# EAGLE schematic PCBNewLdo (EAGLE 9.6.2)
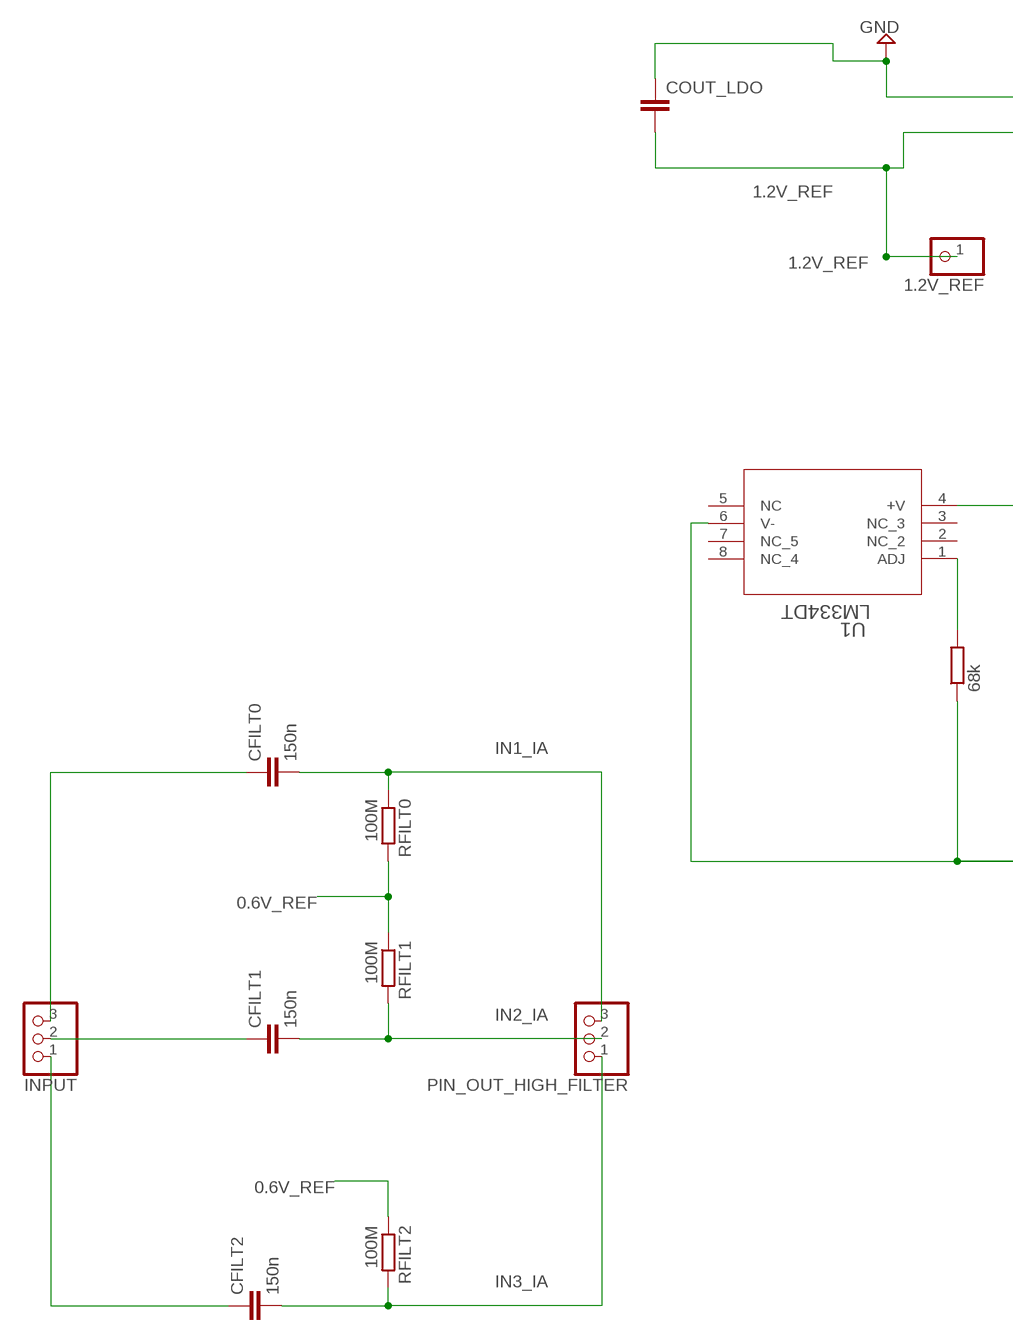
[diagram p0: schematic, sheet 1, part 1 of 2]
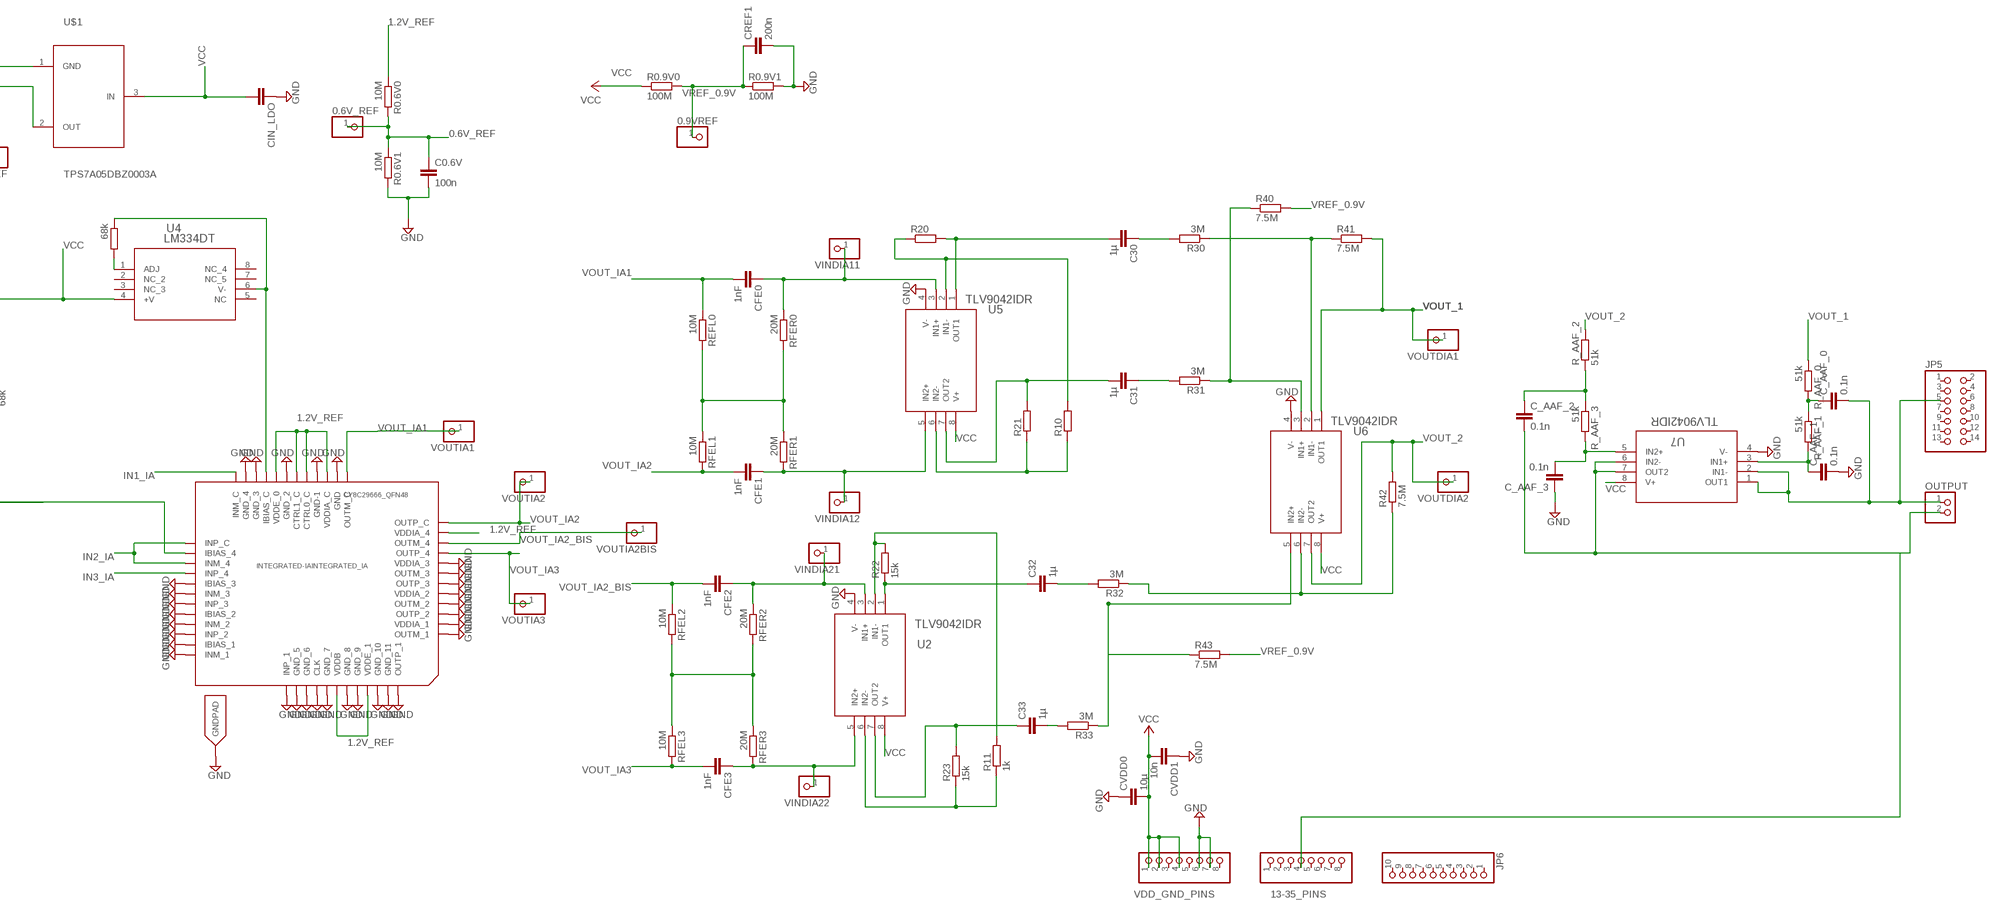
[diagram p1: schematic, sheet 1, part 2 of 2]

## Parts
0.6V_REF  PINHD-1X1  [1X01]
0.9VREF  PINHD-1X1  [1X01]
1.2V_REF  PINHD-1X1  [1X01]
13-35_PINS  PINHD-1X8  [1X08]
C0.6V  100n  C-EUC0603  [C0603]
C30  1µ  C-EUC0603  [C0603]
C31  1µ  C-EUC0603  [C0603]
C32  1µ  C-EUC0603  [C0603]
C33  1µ  C-EUC0603  [C0603]
C_AAF_0  0.1n  C-EUC0603  [C0603]
C_AAF_1  0.1n  C-EUC0603  [C0603]
C_AAF_2  0.1n  C-EUC0603  [C0603]
C_AAF_3  0.1n  C-EUC0603  [C0603]
CFE0  1nF  C-EUC0603  [C0603]
CFE1  1nF  C-EUC0603  [C0603]
CFE2  1nF  C-EUC0603  [C0603]
CFE3  1nF  C-EUC0603  [C0603]
CFILT0  150n  C-EUC0603  [C0603]
CFILT1  150n  C-EUC0603  [C0603]
CFILT2  150n  C-EUC0603  [C0603]
CIN_LDO  1µ  C-EUC0603  [C0603]
COUT_LDO  4.7µ  C-EUC0603  [C0603]
CREF1  200n  C-EUC0603  [C0603]
CVDD0  10µ  C-EUC0603  [C0603]
CVDD1  10n  C-EUC0603  [C0603]
INPUT  PINHD-1X3  [1X03]
INTEGRATED-IA  CY8C29666_QFN48  [QFN48]
JP5  PINHD-2X7  [2X07]
JP6  PINHD-1X10  [1X10]
OUTPUT  PINHD-1X2  [1X02]
PIN_OUT_HIGH_FILTER  PINHD-1X3  [1X03]
R0.6V0  10M  R-EU_R0603  [R0603]
R0.6V1  10M  R-EU_R0603  [R0603]
R0.9V0  100M  R-EU_R0603  [R0603]
R0.9V1  100M  R-EU_R0603  [R0603]
R10  R-EU_R0603  [R0603]
R11  1k  R-EU_R0603  [R0603]
R20  R-EU_R0603  [R0603]
R21  R-EU_R0603  [R0603]
R22  15k  R-EU_R0603  [R0603]
R23  15k  R-EU_R0603  [R0603]
R30  3M  R-EU_R0603  [R0603]
R31  3M  R-EU_R0603  [R0603]
R32  3M  R-EU_R0603  [R0603]
R33  3M  R-EU_R0603  [R0603]
R40  7.5M  R-EU_R0603  [R0603]
R41  7.5M  R-EU_R0603  [R0603]
R42  7.5M  R-EU_R0603  [R0603]
R43  7.5M  R-EU_R0603  [R0603]
R_AAF_0  51k  R-EU_R0603  [R0603]
R_AAF_1  51k  R-EU_R0603  [R0603]
R_AAF_2  51k  R-EU_R0603  [R0603]
R_AAF_3  51k  R-EU_R0603  [R0603]
REFL0  10M  R-EU_R0603  [R0603]
RFEL1  10M  R-EU_R0603  [R0603]
RFEL2  10M  R-EU_R0603  [R0603]
RFEL3  10M  R-EU_R0603  [R0603]
RFER0  20M  R-EU_R0603  [R0603]
RFER1  20M  R-EU_R0603  [R0603]
RFER2  20M  R-EU_R0603  [R0603]
RFER3  20M  R-EU_R0603  [R0603]
RFILT0  100M  R-EU_R0603  [R0603]
RFILT1  100M  R-EU_R0603  [R0603]
RFILT2  100M  R-EU_R0603  [R0603]
RLM334_0  68k  R-EU_R0603  [R0603]
RLM334_1  68k  R-EU_R0603  [R0603]
U1  LM334DT  [SO-8_STM]
U2  TLV9042IDR  [SOIC8_D_TEX]
U4  LM334DT  [SO-8_STM]
U5  TLV9042IDR  [SOIC8_D_TEX]
U6  TLV9042IDR  [SOIC8_D_TEX]
U7  TLV9042IDR  [SOIC8_D_TEX]
U$1  TPS7A05DBZ0003A  [TFE]
VDD_GND_PINS  PINHD-1X8  [1X08]
VINDIA11  PINHD-1X1  [1X01]
VINDIA12  PINHD-1X1  [1X01]
VINDIA21  PINHD-1X1  [1X01]
VINDIA22  PINHD-1X1  [1X01]
VOUTDIA1  PINHD-1X1  [1X01]
VOUTDIA2  PINHD-1X1  [1X01]
VOUTIA1  PINHD-1X1  [1X01]
VOUTIA2  PINHD-1X1  [1X01]
VOUTIA2BIS  PINHD-1X1  [1X01]
VOUTIA3  PINHD-1X1  [1X01]

## Nets
0.6V_REF: 0.6V_REF.1 C0.6V.1 R0.6V0.2 R0.6V1.1 RFILT0.2 RFILT1.1 RFILT2.1
1.2V_REF: 1.2V_REF.1 COUT_LDO.2 INTEGRATED-IA.11(INTEGRATED_IA:VDDIA_4) INTEGRATED-IA.15(INTEGRATED_IA:VDDIA_C) INTEGRATED-IA.17(INTEGRATED_IA:CTRL0_C) INTEGRATED-IA.18(INTEGRATED_IA:CTRL1_C) INTEGRATED-IA.20(INTEGRATED_IA:VDDE_0) INTEGRATED-IA.42(INTEGRATED_IA:VDDB) INTEGRATED-IA.45(INTEGRATED_IA:VDDE_1) R0.6V0.1 U$1.2(OUT)
GND: C0.6V.2 C_AAF_1.2 C_AAF_3.1 CIN_LDO.1 COUT_LDO.1 CREF1.2 CVDD0.1 CVDD1.1 INTEGRATED-IA.1(INTEGRATED_IA:OUTM_1) INTEGRATED-IA.2(INTEGRATED_IA:VDDIA_1) INTEGRATED-IA.3(INTEGRATED_IA:OUTP_2) INTEGRATED-IA.4(INTEGRATED_IA:OUTM_2) INTEGRATED-IA.5(INTEGRATED_IA:VDDIA_2) INTEGRATED-IA.6(INTEGRATED_IA:OUTP_3) INTEGRATED-IA.7(INTEGRATED_IA:OUTM_3) INTEGRATED-IA.8(INTEGRATED_IA:VDDIA_3) INTEGRATED-IA.14(INTEGRATED_IA:GND) INTEGRATED-IA.16(INTEGRATED_IA:GND-1) INTEGRATED-IA.19(INTEGRATED_IA:GND_2) INTEGRATED-IA.22(INTEGRATED_IA:GND_3) INTEGRATED-IA.23(INTEGRATED_IA:GND_4) INTEGRATED-IA.29(INTEGRATED_IA:IBIAS_3) INTEGRATED-IA.30(INTEGRATED_IA:INM_3) INTEGRATED-IA.31(INTEGRATED_IA:INP_3) INTEGRATED-IA.32(INTEGRATED_IA:IBIAS_2) INTEGRATED-IA.33(INTEGRATED_IA:INM_2) INTEGRATED-IA.34(INTEGRATED_IA:INP_2) INTEGRATED-IA.35(INTEGRATED_IA:IBIAS_1) INTEGRATED-IA.36(INTEGRATED_IA:INM_1) INTEGRATED-IA.37(INTEGRATED_IA:INP_1) INTEGRATED-IA.38(INTEGRATED_IA:GND_5) INTEGRATED-IA.39(INTEGRATED_IA:GND_6) INTEGRATED-IA.40(INTEGRATED_IA:CLK) INTEGRATED-IA.41(INTEGRATED_IA:GND_7) INTEGRATED-IA.43(INTEGRATED_IA:GND_8) INTEGRATED-IA.44(INTEGRATED_IA:GND_9) INTEGRATED-IA.46(INTEGRATED_IA:GND_10) INTEGRATED-IA.47(INTEGRATED_IA:GND_11) INTEGRATED-IA.48(INTEGRATED_IA:OUTP_1) INTEGRATED-IA.EXP(GNDPAD) R0.6V1.2 R0.9V1.2 U2.4(V-) U5.4(V-) U6.4(V-) U7.4(V-) U$1.1(GND) VDD_GND_PINS.6 VDD_GND_PINS.7
IN1_IA: CFILT0.2 INTEGRATED-IA.24(INTEGRATED_IA:INM_C) PIN_OUT_HIGH_FILTER.3 RFILT0.1
IN2_IA: CFILT1.2 INTEGRATED-IA.25(INTEGRATED_IA:INP_C) INTEGRATED-IA.27(INTEGRATED_IA:INM_4) PIN_OUT_HIGH_FILTER.2 RFILT1.2
IN3_IA: CFILT2.2 INTEGRATED-IA.28(INTEGRATED_IA:INP_4) PIN_OUT_HIGH_FILTER.1 RFILT2.2
N$1: C33.2 R33.2
N$2: C32.1 R22.1 U2.1(OUT1)
N$3: C32.2 R32.2
N$4: R32.1 R42.1 U6.6(IN2-)
N$5: CFILT2.1 INPUT.1
N$6: R33.1 R43.1 U6.5(IN2+)
N$7: REFL0.2 RFEL1.1 RFER0.2 RFER1.1
N$8: R31.1 R40.1 U6.3(IN1+)
N$9: C31.1 R31.2
N$10: C30.1 R30.2
N$11: C31.2 R21.2 U5.7(OUT2)
N$12: RLM334_1.2 U1.1(ADJ)
N$14: CFILT0.1 INPUT.3
N$17: RLM334_0.2 U4.1(ADJ)
N$18: C_AAF_2.1 R_AAF_2.1 R_AAF_3.1
N$20: C30.2 R20.2 U5.1(OUT1)
N$21: C_AAF_0.1 R_AAF_0.2 R_AAF_1.1
N$22: C_AAF_1.1 R_AAF_1.2 U7.3(IN1+)
N$23: C_AAF_3.2 R_AAF_3.2 U7.5(IN2+)
N$24: 13-35_PINS.4 C_AAF_2.2 OUTPUT.2 U7.6(IN2-) U7.7(OUT2)
N$25: C_AAF_0.2 JP5.5 OUTPUT.1 U7.1(OUT1) U7.2(IN1-)
N$26: R30.1 R41.1 U6.2(IN1-)
N$27: R10.1 R21.1 U5.6(IN2-)
N$28: C33.1 R23.2 U2.7(OUT2)
N$29: R11.1 R23.1 U2.6(IN2-)
N$30: R10.2 R20.1 U5.2(IN1-)
N$31: INTEGRATED-IA.26(INTEGRATED_IA:IBIAS_4) RLM334_1.1 U1.6(V-)
N$32: R11.2 R22.2 U2.2(IN1-)
N$33: CFE3.1 RFER3.2 U2.5(IN2+) VINDIA22.1
N$34: RFEL2.2 RFEL3.1 RFER2.2 RFER3.1
N$36: CFE2.1 RFER2.1 U2.3(IN1+) VINDIA21.1
N$38: INTEGRATED-IA.21(INTEGRATED_IA:IBIAS_C) RLM334_0.1 U4.6(V-)
N$39: CFE0.1 RFER0.1 U5.3(IN1+) VINDIA11.1
N$40: CFE1.1 RFER1.2 U5.5(IN2+) VINDIA12.1
N$45: CFILT1.1 INPUT.2
VCC: CIN_LDO.2 CVDD0.2 CVDD1.2 R0.9V0.1 U1.4(+V) U2.8(V+) U4.4(+V) U5.8(V+) U6.8(V+) U7.8(V+) U$1.3(IN) VDD_GND_PINS.1 VDD_GND_PINS.2 VDD_GND_PINS.4
VOUT_1: R41.2 R_AAF_0.1 U6.1(OUT1) VOUTDIA1.1
VOUT_2: R42.2 R_AAF_2.2 U6.7(OUT2) VOUTDIA2.1
VOUT_IA1: CFE0.2 INTEGRATED-IA.13(INTEGRATED_IA:OUTM_C) REFL0.1 VOUTIA1.1
VOUT_IA2: CFE1.2 INTEGRATED-IA.12(INTEGRATED_IA:OUTP_C) RFEL1.2 VOUTIA2.1
VOUT_IA2_BIS: CFE2.2 INTEGRATED-IA.10(INTEGRATED_IA:OUTM_4) RFEL2.1 VOUTIA2BIS.1
VOUT_IA3: CFE3.2 INTEGRATED-IA.9(INTEGRATED_IA:OUTP_4) RFEL3.2 VOUTIA3.1
VREF_0.9V: 0.9VREF.1 CREF1.1 R0.9V0.2 R0.9V1.1 R40.2 R43.2
Unconnected: 13-35_PINS.1 13-35_PINS.2 13-35_PINS.3 13-35_PINS.5 13-35_PINS.6 13-35_PINS.7 13-35_PINS.8 JP5.1 JP5.2 JP5.3 JP5.4 JP5.6 JP5.7 JP5.8 JP5.9 JP5.10 JP5.11 JP5.12 JP5.13 JP5.14 JP6.1 JP6.2 JP6.3 JP6.4 JP6.5 JP6.6 JP6.7 JP6.8 JP6.9 JP6.10 U1.2(NC_2) U1.3(NC_3) U1.5(NC) U1.7(NC_5) U1.8(NC_4) U4.2(NC_2) U4.3(NC_3) U4.5(NC) U4.7(NC_5) U4.8(NC_4) VDD_GND_PINS.3 VDD_GND_PINS.5 VDD_GND_PINS.8

## Library data of the parts
0.6V_REF 0.9VREF 1.2V_REF VINDIA11 VINDIA12 VINDIA21 VINDIA22 VOUTDIA1 VOUTDIA2 VOUTIA1 VOUTIA2 VOUTIA2BIS VOUTIA3 = pinhead:PINHD-1X1: PIN HEADER
13-35_PINS VDD_GND_PINS = pinhead:PINHD-1X8: PIN HEADER
C0.6V C30-C33 C_AAF_0 C_AAF_1-C_AAF_3 CFE0 CFE1-CFE3 CFILT0 CFILT1 CFILT2 CIN_LDO COUT_LDO CREF1 CVDD0 CVDD1 = rcl:C-EU: CAPACITOR, European symbol; SPICEPREFIX: C
INPUT PIN_OUT_HIGH_FILTER = pinhead:PINHD-1X3: PIN HEADER
INTEGRATED-IA = cypresspsoc_0.30:CY8C29666_QFN48
JP5 = pinhead:PINHD-2X7: PIN HEADER
JP6 = pinhead:PINHD-1X10: PIN HEADER
OUTPUT = pinhead:PINHD-1X2: PIN HEADER
R0.6V0 R0.6V1 R0.9V0 R0.9V1 R10 R11 R20-R23 R30-R33 R40-R43 R_AAF_0 R_AAF_1-R_AAF_3 REFL0 RFEL1-RFEL3 RFER0 RFER1-RFER3 RFILT0 RFILT1 RFILT2 RLM334_0 RLM334_1 = rcl:R-EU_: RESISTOR, European symbol; SPICEPREFIX: R
U1 U4 = Curren_Ref:LM334DT; BUILT_BY: EMA_UL_Team; MANUFACTURER_PART_NUMBER: LM334DT; SOURCELIBRARY: Update_to_database_2020-11-24; VENDOR: STMicroelectronics
U2 U5-U7 = TLV9042_With_PINS:TLV9042IDR; BUILT_BY: EMA_Cory; COPYRIGHT: Copyright (C) 2018 Accelerated Designs. All rights reserved; DATASHEET: https://www.ti.com/lit/ds/symlink/tlv9042.pdf?ts=1614267059947&ref_url=https%253A%252F%252Fwww.ti.com%252Fstore%252Fti%252Fen%252Fp%252Fproduct%252F%253Fp%253DTLV9042IDR; MANUFACTURER_PART_NUMBER: TLV9042IDR; SOURCELIBRARY: Add_to_database_2021-02-25; VENDOR: Texas Instruments
U$1 = ldotfe:TPS7A05DBZ0003A